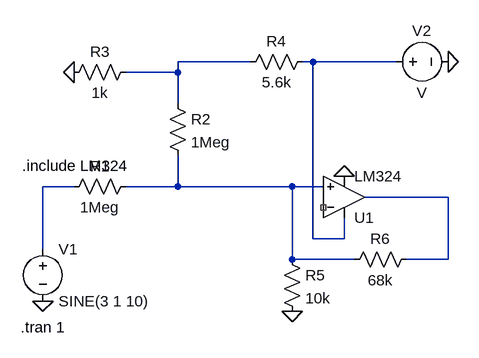
[diagram p0: schematic Draft1.asc]
Draft1.asc, the LTspice schematic file:
Version 4
SHEET 1 880 680
WIRE 352 -160 240 -160
WIRE 448 -160 432 -160
WIRE 576 -160 448 -160
WIRE 240 -144 240 -160
WIRE 240 -144 160 -144
WIRE 240 -96 240 -144
WIRE 80 32 32 32
WIRE 240 32 240 -16
WIRE 240 32 160 32
WIRE 416 32 240 32
WIRE 464 32 416 32
WIRE 656 48 528 48
WIRE 448 112 448 -160
WIRE 496 112 496 80
WIRE 496 112 448 112
WIRE 32 128 32 32
WIRE 416 144 416 32
WIRE 512 144 416 144
WIRE 656 144 656 48
WIRE 656 144 592 144
FLAG 32 208 0
FLAG 80 -144 0
FLAG 656 -160 0
FLAG 416 224 0
FLAG 496 16 0
SYMBOL voltage 32 112 R0
WINDOW 123 0 0 Left 0
WINDOW 39 0 0 Left 0
SYMATTR InstName V1
SYMATTR Value SINE(3 1 10)
SYMBOL res 176 16 R90
WINDOW 0 0 56 VBottom 2
WINDOW 3 32 56 VTop 2
SYMATTR InstName R1
SYMATTR Value 1Meg
SYMBOL res 224 -112 R0
SYMATTR InstName R2
SYMATTR Value 1Meg
SYMBOL res 176 -160 R90
WINDOW 0 0 56 VBottom 2
WINDOW 3 32 56 VTop 2
SYMATTR InstName R3
SYMATTR Value 1k
SYMBOL res 448 -176 R90
WINDOW 0 0 56 VBottom 2
WINDOW 3 32 56 VTop 2
SYMATTR InstName R4
SYMATTR Value 5.6k
SYMBOL voltage 560 -160 R270
WINDOW 0 32 56 VTop 2
WINDOW 3 -32 56 VBottom 2
SYMATTR InstName V2
SYMBOL OpAmps\\opamp2 496 112 M180
SYMATTR InstName U1
SYMATTR Value LM324
SYMBOL res 400 128 R0
SYMATTR InstName R5
SYMATTR Value 10k
SYMBOL res 608 128 R90
WINDOW 0 0 56 VBottom 2
WINDOW 3 32 56 VTop 2
SYMATTR InstName R6
SYMATTR Value 68k
TEXT -2 248 Left 2 !.tran 1
TEXT 0 0 Left 2 !.include LM324

The netlist it stands for:
* Draft1.asc
V1 N003 0 SINE(3 1 10)
R1 N004 N003 1Meg
R2 N001 N004 1Meg
R3 N001 0 1k
R4 N002 N001 5.6k
V2 N002 0 V
XU1 N004 NC_01 N002 0 N005 LM324  ; pins In+ In- V+ V- OUT
R5 N004 0 10k
R6 N005 N004 68k
.tran 1
.include LM324
.backanno
.end